# Altium schematic sheet STB_MCU.SchDoc: STB Control Board - MCU
size A3; Author: mayerph; DrawnBy: mayerph; Organization: PBL; Revision: B; SheetNumber: 5; SheetTotal: 6
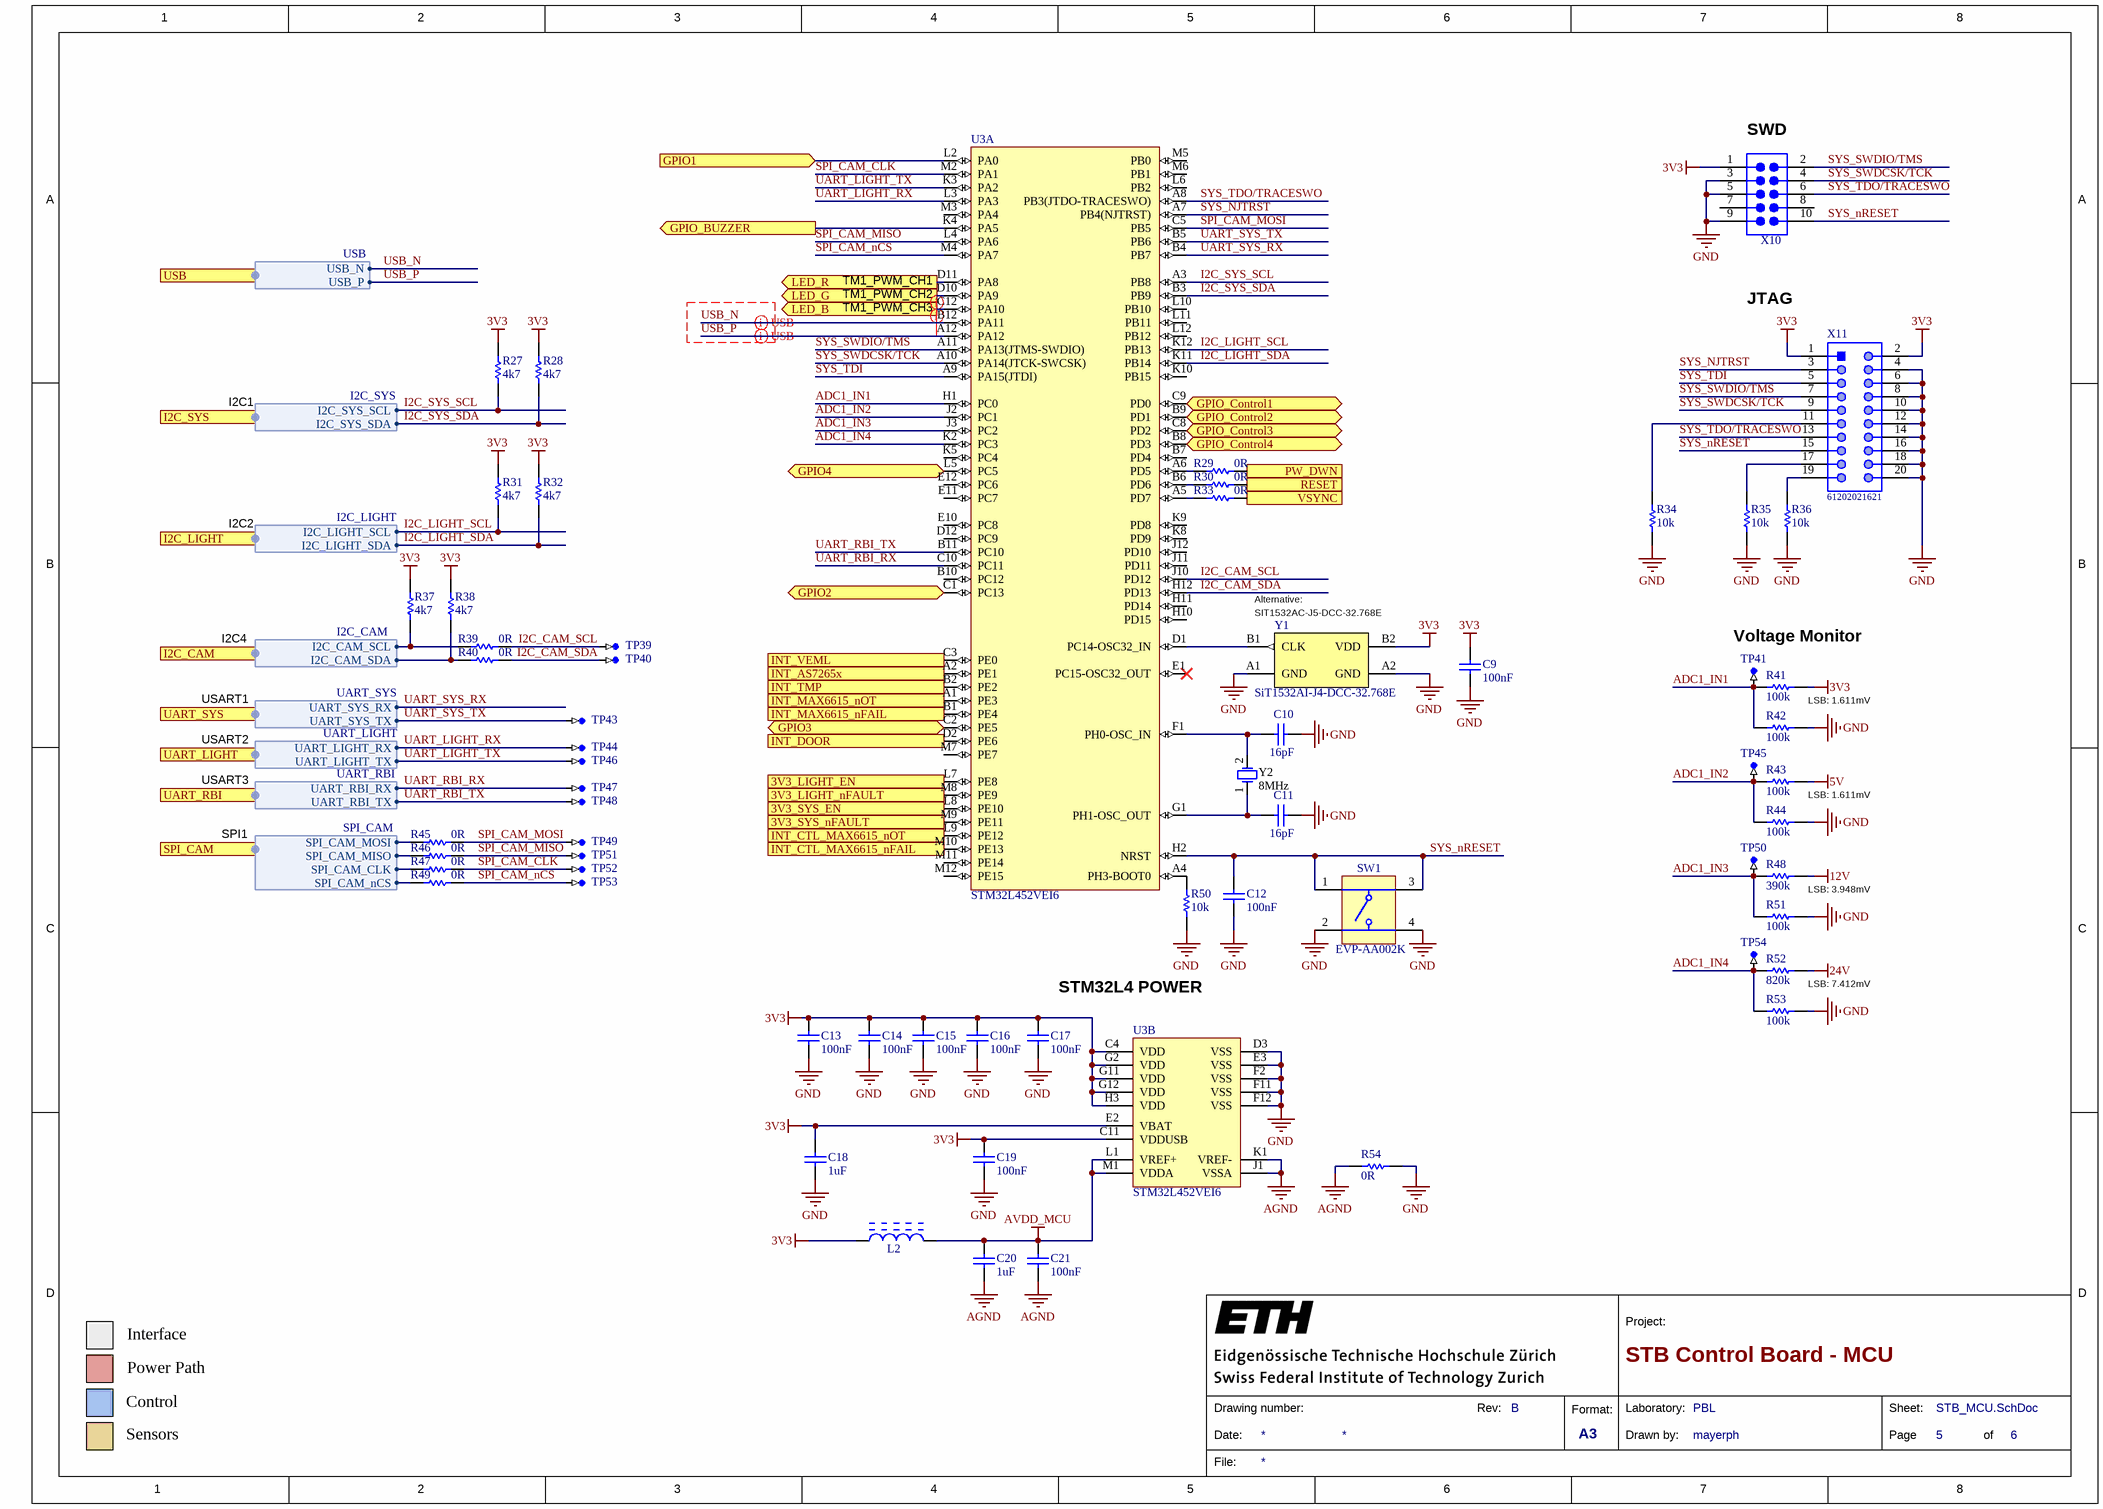
[diagram p0: STB_MCU.SchDoc]

## Parts
C9  100nF  [CAPC1050X55X23LL05T13]
C10  16pF  [CAPC1005X55X25LL05T10]
C11  16pF  [CAPC1005X55X25LL05T10]
C12  100nF  [CAPC1050X55X23LL05T13]
C13  100nF  [CAPC1050X55X23LL05T13]
C14  100nF  [CAPC1050X55X23LL05T13]
C15  100nF  [CAPC1050X55X23LL05T13]
C16  100nF  [CAPC1050X55X23LL05T13]
C17  100nF  [CAPC1050X55X23LL05T13]
C18  1uF  [CAPC1608X90X35LL15T15]
C19  100nF  [CAPC1050X55X23LL05T13]
C20  1uF  [CAPC1608X90X35LL15T15]
C21  100nF  [CAPC1050X55X23LL05T13]
L2  LI0402E300R-10  [INDC1005X07L]  (value not drawn)
R27  4k7  [RESC1005X40X25LL05T10]
R28  4k7  [RESC1005X40X25LL05T10]
R29  0R  [RESC1005X40X25LL05T10]
R30  0R  [RESC1005X40X25LL05T10]
R31  4k7  [RESC1005X40X25LL05T10]
R32  4k7  [RESC1005X40X25LL05T10]
R33  0R  [RESC1005X40X25LL05T10]
R34  10k  [RESC1005X40X25LL05T05]
R35  10k  [RESC1005X40X25LL05T05]
R36  10k  [RESC1005X40X25LL05T05]
R37  4k7  [RESC1005X40X25LL05T10]
R38  4k7  [RESC1005X40X25LL05T10]
R39  0R  [RESC1005X40X25LL05T10]
R40  0R  [RESC1005X40X25LL05T10]
R41  100k  [RESC1005X40X25LL05T10]
R42  100k  [RESC1005X40X25LL05T10]
R43  100k  [RESC1005X40X25LL05T10]
R44  100k  [RESC1005X40X25LL05T10]
R45  0R  [RESC1005X40X25LL05T10]
R46  0R  [RESC1005X40X25LL05T10]
R47  0R  [RESC1005X40X25LL05T10]
R48  390k  [RESC1005X40X25LL05T05]
R49  0R  [RESC1005X40X25LL05T10]
R50  10k  [RESC1005X40X25LL05T05]
R51  100k  [RESC1005X40X25LL05T10]
R52  820k  [RESC1005X40X25LL05T05]
R53  100k  [RESC1005X40X25LL05T10]
R54  0R  [RESC1005X40X25LL05T10]
SW1  EVP-AA002K  [PNSC-EVPAA_V]
TP39  TP_1mm  [TP-SM-C-100]  (value not drawn)  (no BOM)
TP40  TP_1mm  [TP-SM-C-100]  (value not drawn)  (no BOM)
TP41  TP_1mm  [TP-SM-C-100]  (value not drawn)  (no BOM)
TP43  TP_1mm  [TP-SM-C-100]  (value not drawn)  (no BOM)
TP44  TP_1mm  [TP-SM-C-100]  (value not drawn)  (no BOM)
TP45  TP_1mm  [TP-SM-C-100]  (value not drawn)  (no BOM)
TP46  TP_1mm  [TP-SM-C-100]  (value not drawn)  (no BOM)
TP47  TP_1mm  [TP-SM-C-100]  (value not drawn)  (no BOM)
TP48  TP_1mm  [TP-SM-C-100]  (value not drawn)  (no BOM)
TP49  TP_1mm  [TP-SM-C-100]  (value not drawn)  (no BOM)
TP50  TP_1mm  [TP-SM-C-100]  (value not drawn)  (no BOM)
TP51  TP_1mm  [TP-SM-C-100]  (value not drawn)  (no BOM)
TP52  TP_1mm  [TP-SM-C-100]  (value not drawn)  (no BOM)
TP53  TP_1mm  [TP-SM-C-100]  (value not drawn)  (no BOM)
TP54  TP_1mm  [TP-SM-C-100]  (value not drawn)  (no BOM)
U3  STM32L452VEI6  [UFBGA100]  (parts A,B of 2)
X10  3220-10-0100-00  [3220-10-0100-00]  (value not drawn)
X11  61202021621  [61202021621]
Y1  SiT1532AI-J4-DCC-32.768E  [4-UFBGA]
Y2  8MHz  [NDK-NX3225GD-8MHZ-STD-CRA-3_V]

## Ports
3V3_LIGHT_EN (out, see STB_ControlBoard[5B]), 3V3_LIGHT_nFAULT (in, see STB_ControlBoard[5B]), 3V3_SYS_EN (out, see STB_ControlBoard[5C]), 3V3_SYS_nFAULT (in, see STB_ControlBoard[5C]), GPIO1 (in, see STB_ControlBoard[5B]), GPIO2 (bidir, see STB_ControlBoard[5C]), GPIO3 (bidir, see STB_ControlBoard[5A]), GPIO4 (bidir, see STB_ControlBoard[5B]), GPIO_BUZZER (out, see STB_ControlBoard[4B]), GPIO_Control1 (bidir, see STB_ControlBoard[4B]), GPIO_Control2 (bidir, see STB_ControlBoard[4B]), GPIO_Control3 (bidir, see STB_ControlBoard[4B]), GPIO_Control4 (bidir, see STB_ControlBoard[4B]), I2C_CAM (harness I2C_CAM, see STB_ControlBoard[4C]), I2C_LIGHT (harness I2C_LIGHT, see STB_ControlBoard[5A]), I2C_SYS (harness I2C_SYS, see STB_ControlBoard[5B]), INT_AS7265x (in, see STB_ControlBoard[5C]), INT_CTL_MAX6615_nFAIL (in, see STB_ControlBoard[5C]), INT_CTL_MAX6615_nOT (in, see STB_ControlBoard[5C]), INT_DOOR (in, see STB_ControlBoard[5C]), INT_MAX6615_nFAIL (in, see STB_ControlBoard[5C]), INT_MAX6615_nOT (in, see STB_ControlBoard[5C]), INT_TMP (in, see STB_ControlBoard[5C]), INT_VEML (in, see STB_ControlBoard[5C]), LED_B (out, see STB_ControlBoard[4B]), LED_G (out, see STB_ControlBoard[4B]), LED_R (out, see STB_ControlBoard[4B]), PW_DWN (out, see STB_ControlBoard[4B]), RESET (out, see STB_ControlBoard[4B]), SPI_CAM (harness SPI_CAM, see STB_ControlBoard[4C]), UART_LIGHT (harness UART_LIGHT, see STB_ControlBoard[5A]), UART_RBI (harness UART_RBI, see STB_ControlBoard[4B]), UART_SYS (harness UART_SYS, see STB_ControlBoard[5B]), USB (harness USB, see STB_ControlBoard[4A], STB_USB[3B]), VSYNC (in, see STB_ControlBoard[4C])

## Harnesses
USB: USB_N, USB_P
I2C_SYS: I2C_SYS_SDA, I2C_SYS_SCL
I2C_LIGHT: I2C_LIGHT_SDA, I2C_LIGHT_SCL
UART_RBI: UART_RBI_TX, UART_RBI_RX
UART_SYS: UART_SYS_TX, UART_SYS_RX
UART_LIGHT: UART_LIGHT_TX, UART_LIGHT_RX
SPI_CAM: SPI_CAM_MISO, SPI_CAM_MOSI, SPI_CAM_CLK, SPI_CAM_nCS
I2C_CAM: I2C_CAM_SDA, I2C_CAM_SCL

## Nets
3V3: C9.2 C13.2 C14.2 C15.2 C16.2 C17.2 C18.2 C19.2 L2.1 R27.2 R28.2 R31.2 R32.2 R37.2 R38.2 R41.1 U3.C4(VDD) U3.C11(VDDUSB) U3.E2(VBAT) U3.G2(VDD) U3.G11(VDD) U3.G12(VDD) U3.H3(VDD) X10.1 X11.1 X11.2 Y1.B2(VDD)
5V: R43.1
12V: R48.2
24V: R52.2
AGND: C20.1 C21.1 R54.1 U3.J1(VSSA) U3.K1(VREF-)
AVDD_MCU: C20.2 C21.2 L2.2 U3.L1(VREF+) U3.M1(VDDA)
GND: C9.1 C10.2 C11.2 C12.1 C13.1 C14.1 C15.1 C16.1 C17.1 C18.1 C19.1 R34.1 R35.1 R36.1 R42.1 R44.1 R50.1 R51.1 R53.1 R54.2 SW1.2(B) SW1.4(B') U3.D3(VSS) U3.E3(VSS) U3.F2(VSS) U3.F11(VSS) U3.F12(VSS) X10.3 X10.5 X10.9 X11.4 X11.6 X11.8 X11.10 X11.12 X11.14 X11.16 X11.18 X11.20 Y1.A1(GND) Y1.A2(GND)
3V3_LIGHT_EN: U3.L7(PE8) ; port 3V3_LIGHT_EN
3V3_LIGHT_nFAULT: U3.M8(PE9) ; port 3V3_LIGHT_nFAULT
3V3_SYS_EN: U3.L8(PE10) ; port 3V3_SYS_EN
3V3_SYS_nFAULT: U3.M9(PE11) ; port 3V3_SYS_nFAULT
ADC1_IN1: R41.2 R42.2 TP41.TP U3.H1(PC0)
ADC1_IN2: R43.2 R44.2 TP45.TP U3.J2(PC1)
ADC1_IN3: R48.1 R51.2 TP50.TP U3.J3(PC2)
ADC1_IN4: R52.1 R53.2 TP54.TP U3.K2(PC3)
GPIO1: U3.L2(PA0) ; port GPIO1
GPIO2: U3.C1(PC13) ; port GPIO2
GPIO3: U3.C2(PE5) ; port GPIO3
GPIO4: U3.L5(PC5) ; port GPIO4
GPIO_BUZZER: U3.K4(PA5) ; port GPIO_BUZZER
GPIO_Control1: U3.C9(PD0) ; port GPIO_Control1
GPIO_Control2: U3.B9(PD1) ; port GPIO_Control2
GPIO_Control3: U3.C8(PD2) ; port GPIO_Control3
GPIO_Control4: U3.B8(PD3) ; port GPIO_Control4
I2C_CAM_SCL: R39.2 TP39.TP U3.J10(PD12)
I2C_CAM_SDA: R40.2 TP40.TP U3.H12(PD13)
I2C_LIGHT_SCL: R31.1 U3.K12(PB13) ; port I2C_LIGHT.I2C_LIGHT_SCL
I2C_LIGHT_SDA: R32.1 U3.K11(PB14) ; port I2C_LIGHT.I2C_LIGHT_SDA
I2C_SYS_SCL: R27.1 U3.A3(PB8) ; port I2C_SYS.I2C_SYS_SCL
I2C_SYS_SDA: R28.1 U3.B3(PB9) ; port I2C_SYS.I2C_SYS_SDA
INT_AS7265x: U3.A2(PE1) ; port INT_AS7265x
INT_CTL_MAX6615_nFAIL: U3.M10(PE13) ; port INT_CTL_MAX6615_nFAIL
INT_CTL_MAX6615_nOT: U3.L9(PE12) ; port INT_CTL_MAX6615_nOT
INT_DOOR: U3.D2(PE6) ; port INT_DOOR
INT_MAX6615_nFAIL: U3.B1(PE4) ; port INT_MAX6615_nFAIL
INT_MAX6615_nOT: U3.A1(PE3) ; port INT_MAX6615_nOT
INT_TMP: U3.B2(PE2) ; port INT_TMP
INT_VEML: U3.C3(PE0) ; port INT_VEML
LED_B: U3.C12(PA10) ; port LED_B
LED_G: U3.D10(PA9) ; port LED_G
LED_R: U3.D11(PA8) ; port LED_R
PW_DWN: R29.2 ; port PW_DWN
RESET: R30.2 ; port RESET
SPI_CAM_CLK: R47.2 TP52.TP U3.M2(PA1)
SPI_CAM_MISO: R46.2 TP51.TP U3.L4(PA6)
SPI_CAM_MOSI: R45.2 TP49.TP U3.C5(PB5)
SPI_CAM_nCS: R49.2 TP53.TP U3.M4(PA7)
SYS_NJTRST: U3.A7(PB4(NJTRST)) X11.3
SYS_nRESET: C12.2 SW1.1(A) SW1.3(A') U3.H2(NRST) X10.10 X11.15
SYS_SWDCSK/TCK: U3.A10(PA14(JTCK-SWCSK)) X10.4 X11.9
SYS_SWDIO/TMS: U3.A11(PA13(JTMS-SWDIO)) X10.2 X11.7
SYS_TDI: U3.A9(PA15(JTDI)) X11.5
SYS_TDO/TRACESWO: U3.A8(PB3(JTDO-TRACESWO)) X10.6 X11.13
UART_LIGHT_RX: TP44.TP U3.L3(PA3) ; port UART_LIGHT.UART_LIGHT_RX
UART_LIGHT_TX: TP46.TP U3.K3(PA2) ; port UART_LIGHT.UART_LIGHT_TX
UART_RBI_RX: TP47.TP U3.C10(PC11) ; port UART_RBI.UART_RBI_RX
UART_RBI_TX: TP48.TP U3.B11(PC10) ; port UART_RBI.UART_RBI_TX
UART_SYS_RX: U3.B4(PB7) ; port UART_SYS.UART_SYS_RX
UART_SYS_TX: TP43.TP U3.B5(PB6) ; port UART_SYS.UART_SYS_TX
USB_N: U3.B12(PA11) ; port USB.USB_N
USB_P: U3.A12(PA12) ; port USB.USB_P
VSYNC: R33.2 ; port VSYNC
NetC10_1: C10.1 U3.F1(PH0-OSC_IN) Y2.2
NetC11_1: C11.1 U3.G1(PH1-OSC_OUT) Y2.1
NetR29_1: R29.1 U3.A6(PD5)
NetR30_1: R30.1 U3.B6(PD6)
NetR33_1: R33.1 U3.A5(PD7)
NetR34_2: R34.2 X11.11
NetR35_2: R35.2 X11.17
NetR36_2: R36.2 X11.19
NetR37_1: R37.1 R39.1 ; port I2C_CAM.I2C_CAM_SCL
NetR38_1: R38.1 R40.1 ; port I2C_CAM.I2C_CAM_SDA
NetR45_1: R45.1 ; port SPI_CAM.SPI_CAM_MOSI
NetR46_1: R46.1 ; port SPI_CAM.SPI_CAM_MISO
NetR47_1: R47.1 ; port SPI_CAM.SPI_CAM_CLK
NetR49_1: R49.1 ; port SPI_CAM.SPI_CAM_nCS
NetR50_2: R50.2 U3.A4(PH3-BOOT0)
NetU3_D1: U3.D1(PC14-OSC32_IN) Y1.B1(CLK)

Not connected (* = marked no-connect by the designer): U3 B7(PD4) B10(PC12) D12(PC9) E1(PC15-OSC32_OUT)* E10(PC8) E11(PC7) E12(PC6) H10(PD15) H11(PD14) J11(PD11) J12(PD10) K5(PC4) K8(PD9) K9(PD8) K10(PB15) L6(PB2) L10(PB10) L11(PB11) L12(PB12) M3(PA4) M5(PB0) M6(PB1) M7(PE7) M11(PE14) M12(PE15); X10 7 8

## Layout directives
differential pair; differential pair class USB_90R: USB_N, USB_P
net class USB: USB_N, USB_P

## Notes on the sheet
- (near X10) SWD
- TM1_PWM_CH1
- TM1_PWM_CH2
- TM1_PWM_CH3
- JTAG
- I2C1
- I2C2
- I2C4
- (near Y1) Alternative:
- (near Y1) SIT1532AC-J5-DCC-32.768E
- Voltage Monitor
- USART1
- LSB: 1.611mV
- USART2
- USART3
- SPI1
- LSB: 3.948mV
- STM32L4 POWER
- LSB: 7.412mV
- 1
- 2
- 3
- 4
- 5
- 6
- 7
- 8
- A
- B
- C
- D
- Project:
- Interface
- Power Path
- Control
- Sensors
- Date:
- Drawing number:
- Rev:
- Format:
- A3
- Drawn by:
- Laboratory:
- Page
- Sheet:
- of
- File:

## Library data of the parts
C9 C12-C17 C19 C21 = CMP-2000-05439-1: Chip Capacitor, 100 nF, +/- 10%, 16 V, -55 to 125 degC, 0402 (1005 Metric), RoHS, Tape and Reel; Manufacturer: Samsung Electro-Mechanics; Manufacturer Part Number: CL05B104KO5NNNC; Dielectric: X7R; Rated Voltage: 16V; Dielectric Material: Ceramic; Multilayer: Yes; Case Size/Dimension: 0402; Tolerance (%): ±10%; Value: 100nF; Manufacturer URL: http://www.samsungsem.com/global/index.jsp; Datasheet URL: https://datasheet.ciiva.com/29198/458718-da-01-en-vs-kondensator-0402-29198423.pdf; Datasheet Version: Nov-10; Supplier 1: Digi-Key; Supplier Part Number 1: 1276-1001-6-ND; RoHS: Yes; Category: Ceramic Capacitors; Stock 1: 24854634; Pricing 1: 1=0.10000, 10=0.02400, 50=0.01300, 100=0.01050, 500=0.00752, 1000=0.00592, 2500=0.00538, 5000=0.00495 (USD); Mount: Surface Mount; Number of Pins: 2; Package Shape: Rectangular; Size Code: 0402; Terminal Finish: Nickel; Min Operating Temperature: -55°C; Max Operating Temperature: 125°C; JESD-609 Code: e3; Capacitor Type: Ceramic; Negative Tolerance: 10%; Packaging: Tape and Reel; Positive Tolerance: 10%; Rated DC Voltage (URdc): 16V; Temperature Characteristics Code: X7R; Termination: Wraparound; Package Style: SMTMeter; Length: 1mm; Width: 0.5mm; Height: 0.55mm; REACH SVHC: Yes; RoHS Compliant: Yes; ComponentLink1URL: https://datasheet.ciiva.com:443/pdfs/VipMasterIC/IC/SEMS/SEMS-S-A0008384515/SEMS-S-A0008872921-1.pdf?src-supplier=IHS+Markit; ComponentLink1Description: https://datasheet.ciiva.com:443/pdfs/VipMasterIC/IC/SEMS/SEMS-S-A0008384515/SEMS-S-A0008872921-1.pdf?src-supplier=IHS+Markit; ComponentLink2URL: https://datasheet.ciiva.com/26920/getdatasheetpartid-359683-26920169.pdf?src-supplier=Verical; ComponentLink2Description: https://datasheet.ciiva.com/26920/getdatasheetpartid-359683-26920169.pdf?src-supplier=Verical; ComponentLink3URL: https://datasheet.ciiva.com/29198/458718-da-01-en-vs-kondensator-0402-29198423.pdf?src-supplier=Conrad; ComponentLink3Description: https://datasheet.ciiva.com/29198/458718-da-01-en-vs-kondensator-0402-29198423.pdf?src-supplier=Conrad; ComponentLink4URL: https://datasheet.ciiva.com/26309/mlcc-catalogdownload2013-eng-26309003.pdf?src-supplier=Distrelec; ComponentLink4Description: https://datasheet.ciiva.com/26309/mlcc-catalogdownload2013-eng-26309003.pdf?src-supplier=Distrelec; ComponentLink5URL: https://datasheet.ciiva.com/16208/cl05b104kq5nnnc-16208343.pdf?src-supplier=Future+Electronics; ComponentLink5Description: https://datasheet.ciiva.com/16208/cl05b104kq5nnnc-16208343.pdf?src-supplier=Future+Electronics
C10 C11 = CMP-2008-03924-1: Manufacturer: Murata; Part Number: GRM1555C1H160JA01D; Dielectric Material: Ceramic; Multilayer: Yes; Negative Tolerance: 5%; Rated DC Voltage (URdc): 50V; Temperature Characteristics Code: C0G; Supplier 1: Digi-Key; Supplier Part Number 1: 490-5926-6-ND; Manufacturer Part Number: GRM1555C1H160JA01D; RoHS: Yes; Category: Ceramic Capacitors; Stock 1: 2256141; Pricing 1: 1=0.10000, 10=0.05200, 50=0.02840, 100=0.02330, 500=0.01662, 1000=0.01305, 2500=0.01187, 5000=0.01092 (USD); Mount: Surface Mount; Number of Pins: 2; Size Code: 0402; Package Shape: Rectangular; Terminal Finish: Nickel; Min Operating Temperature: -55°C; Max Operating Temperature: 125°C; Value: 16pF; Capacitor Type: Ceramic; Packaging: Tape and Reel; Positive Tolerance: 5%; JESD-609 Code: e3; Termination: Wraparound; Package Style: SMTMeter; Length: 1mm; Width: 0.5mm; Height: 0.5mm; Reach SVHC Compliant: Yes; RoHS Compliant: Yes; ComponentLink1URL: https://datasheet.ciiva.com:443/pdfs/VipMasterIC/IC/MURE/MURE-S-A0004347008/MURE-S-A0004347353-1.pdf?src-supplier=IHS+Markit; ComponentLink1Description: https://datasheet.ciiva.com:443/pdfs/VipMasterIC/IC/MURE/MURE-S-A0004347008/MURE-S-A0004347353-1.pdf?src-supplier=IHS+Markit; ComponentLink2URL: https://datasheet.ciiva.com/6256/grm1555c1h160ja01-01-6256808.pdf?src-supplier=Digi-Key; ComponentLink2Description: https://datasheet.ciiva.com/6256/grm1555c1h160ja01-01-6256808.pdf?src-supplier=Digi-Key; ComponentLink3URL: https://datasheet.ciiva.com/3778/10932grm1555c1h160ja0123-3778199.pdf?src-supplier=Arrow+Electronics; ComponentLink3Description: https://datasheet.ciiva.com/3778/10932grm1555c1h160ja0123-3778199.pdf?src-supplier=Arrow+Electronics; ComponentLink4URL: https://datasheet.ciiva.com/18184/getdatasheetpartid-319096-18184204.pdf?src-supplier=Verical; ComponentLink4Description: https://datasheet.ciiva.com/18184/getdatasheetpartid-319096-18184204.pdf?src-supplier=Verical; ComponentLink5URL: https://datasheet.ciiva.com/22698/1666664-22698393.pdf?src-supplier=Element14; ComponentLink5Description: https://datasheet.ciiva.com/22698/1666664-22698393.pdf?src-supplier=Element14; ComponentLink6URL: https://datasheet.ciiva.com/6256/partnumbering-e-01-6256810.pdf?src-supplier=Digi-Key; ComponentLink6Description: https://datasheet.ciiva.com/6256/partnumbering-e-01-6256810.pdf?src-supplier=Digi-Key; ComponentLink7URL: https://datasheet.ciiva.com/6256/partnumbering-e-01-6256812.pdf?src-supplier=Digi-Key; ComponentLink7Description: https://datasheet.ciiva.com/6256/partnumbering-e-01-6256812.pdf?src-supplier=Digi-Key; ComponentLink8URL: https://datasheet.ciiva.com/5426/product-5426941.pdf?src-supplier=Mouser; ComponentLink8Description: https://datasheet.ciiva.com/5426/product-5426941.pdf?src-supplier=Mouser
C18 C20 = CMP-2006-02298-2: Manufacturer: Kemet; Part Number: C0603C105K4RACTU; Dielectric Material: Ceramic; Multilayer: Yes; Negative Tolerance: 10%; Rated DC Voltage (URdc): 16V; Temperature Characteristics Code: X7R; Supplier 1: Digi-Key; Supplier Part Number 1: 399-C0603C105K4RAC7867DKR-ND; Manufacturer Part Number: C0603C105K4RACTU; RoHS: Yes; Category: Ceramic Capacitors; Stock 1: 1549593; Pricing 1: 1=0.10000, 10=0.07700, 50=0.04180, 100=0.03410, 500=0.02440, 1000=0.01916 (USD); Mount: Surface Mount; Number of Pins: 2; Package Shape: Rectangular; Size Code: 0603; Terminal Finish: Nickel; Min Operating Temperature: -55°C; Max Operating Temperature: 125°C; Value: 1uF; Capacitor Type: Ceramic; Packaging: Tape and Reel; Positive Tolerance: 10%; Termination: Wraparound; JESD-609 Code: e3; Package Style: SMTMeter; Length: 1.6mm; Width: 0.8mm; Height: 0.8mm; REACH SVHC: Yes; RoHS Compliant: Yes; ComponentLink1URL: https://datasheet.ciiva.com:443/pdfs/VipMasterIC/IC/KEME/KEME-S-A0008991654/KEME-S-A0008991654-1.pdf?src-supplier=IHS+Markit; ComponentLink1Description: https://datasheet.ciiva.com:443/pdfs/VipMasterIC/IC/KEME/KEME-S-A0008991654/KEME-S-A0008991654-1.pdf?src-supplier=IHS+Markit
L2 = CMP-00193-1: 30 Ohm 1 Power, Signal Line Ferrite Bead 0402 (1005 Metric) 500mA 300 mOhm Max DCR; Manufacturer: Laird-Signal Integrity Products; Number of Lines: 1; Impedance @ Frequency: 30 Ohm @ 100MHz; Packaging: Cut Tape (CT); Part Status: Active; Filter Type: Power, Signal Line; Current Rating (Max): 500mA; DC Resistance (DCR) (Max): 300 mOhm; Ratings: -; Operating Temperature: -40°C ~ 125°C; Package / Case: 0402 (1005 Metric); Mounting Type: Surface Mount; Manufacturer Part Number: LI0402E300R-10; Supplier: Digi-Key; Supplier Part Number: 240-2362-1-ND; ComponentLink1Description: Catalog_EMI%20Filtering%20&%20RF%20Inductors.pdf; ComponentLink1URL: http://cdn.lairdtech.com/home/brandworld/files/Catalog_EMI%20Filtering%20&%20RF%20Inductors.pdf
R27 R28 R31 R32 R37 R38 = CMP-1011-00586-2: Manufacturer: Yageo / Phycomp; Part Number: RC0402FR-074K7L; Tolerance: 1%; Rated Power Dissipation (P): 62.5mW; Rated Temperature: 70°C; Value: 4.7 kOhm; Temperature Coefficient: 100ppm/°C; Working Voltage: 50V; Additional Feature: LASER TRIMMABLE; Package Height: 0.35mm; Package Length: 1mm; Package Width: 0.5mm; Supplier 1: Digi-Key; Supplier Part Number 1: 311-4.7KLRDKR-ND; Manufacturer Part Number: RC0402FR-074K7L; RoHS: Yes; Category: Chip SMD Resistors; Stock 1: 23638739; Pricing 1: 1=0.10000, 10=0.01500, 100=0.00600, 1000=0.00267, 2500=0.00232, 5000=0.00192 (USD); Mount: Surface Mount; Number of Pins: 2; Package Shape: Rectangular; Size Code: 0402; Terminal Finish: Nickel; Min Operating Temperature: -55°C; Max Operating Temperature: 155°C; Resistor Type: FIXED RESISTOR; Packaging: Tape and Reel; Technology: METAL GLAZE/THICK FILM; Termination: Wraparound; JESD-609 Code: e3; Construction: Chip; Package Style: SMTMeter; REACH SVHC: Yes; RoHS Compliant: Yes; ComponentLink1URL: https://datasheet.ciiva.com:443/pdfs/VipMasterIC/IC/YAGO/YAGO-S-A0008145938/YAGO-S-A0008145938-1.pdf?src-supplier=IHS+Markit; ComponentLink1Description: https://datasheet.ciiva.com:443/pdfs/VipMasterIC/IC/YAGO/YAGO-S-A0008145938/YAGO-S-A0008145938-1.pdf?src-supplier=IHS+Markit; ComponentLink2URL: https://datasheet.ciiva.com/22661/1686128-22661342.pdf?src-supplier=Element14; ComponentLink2Description: https://datasheet.ciiva.com/22661/1686128-22661342.pdf?src-supplier=Element14; ComponentLink3URL: https://datasheet.ciiva.com/7850/1018594-7850022.pdf?src-supplier=Element14; ComponentLink3Description: https://datasheet.ciiva.com/7850/1018594-7850022.pdf?src-supplier=Element14; ComponentLink4URL: https://datasheet.ciiva.com/7850/1018594-7850023.pdf?src-supplier=Element14; ComponentLink4Description: https://datasheet.ciiva.com/7850/1018594-7850023.pdf?src-supplier=Element14; ComponentLink5URL: https://datasheet.ciiva.com/15215/getdatasheetpartid-328119-15215035.pdf?src-supplier=Verical; ComponentLink5Description: https://datasheet.ciiva.com/15215/getdatasheetpartid-328119-15215035.pdf?src-supplier=Verical
R29 R30 R33 R39 R40 R45-R47 R49 R54 = CMP-1011-00001-2: Manufacturer: Yageo / Phycomp; Part Number: RC0402JR-070RL; Rated Power Dissipation (P): 62.5mW; Rated Temperature: 70°C; Package Height: 0.35mm; Package Length: 1mm; Package Width: 0.5mm; Supplier 1: Digi-Key; Supplier Part Number 1: 311-0.0JRDKR-ND; Manufacturer Part Number: RC0402JR-070RL; RoHS: Yes; Category: Chip SMD Resistors; Stock 1: 41330354; Pricing 1: 1=0.10000, 10=0.01200, 25=0.00840, 50=0.00640, 100=0.00480, 250=0.00364, 500=0.00290, 1000=0.00214, 5000=0.00154 (USD); Mount: Surface Mount; Number of Pins: 2; Size Code: 0402; Package Shape: Rectangular; Terminal Finish: Nickel; Min Operating Temperature: -55°C; Max Operating Temperature: 155°C; Resistor Type: FIXED RESISTOR; Value: 0R; Packaging: Tape and Reel; Technology: METAL GLAZE/THICK FILM; Termination: Wraparound; JESD-609 Code: e3; Construction: Chip; Package Style: SMTMeter; REACH SVHC: Yes; RoHS Compliant: Yes; ComponentLink1URL: https://datasheet.ciiva.com:443/pdfs/VipMasterIC/IC/YAGO/YAGO-S-A0008145938/YAGO-S-A0008145938-1.pdf?src-supplier=IHS+Markit; ComponentLink1Description: https://datasheet.ciiva.com:443/pdfs/VipMasterIC/IC/YAGO/YAGO-S-A0008145938/YAGO-S-A0008145938-1.pdf?src-supplier=IHS+Markit; ComponentLink2URL: https://datasheet.ciiva.com/2452/pyu-rc0402-51-rohs-l-6-2452608.pdf?src-supplier=Digi-Key; ComponentLink2Description: https://datasheet.ciiva.com/2452/pyu-rc0402-51-rohs-l-6-2452608.pdf?src-supplier=Digi-Key; ComponentLink3URL: https://datasheet.ciiva.com/11808/0900766b80c66297-11808195.pdf?src-supplier=RSComponents; ComponentLink3Description: https://datasheet.ciiva.com/11808/0900766b80c66297-11808195.pdf?src-supplier=RSComponents; ComponentLink4URL: https://datasheet.ciiva.com/7983/1018594-7983535.pdf?src-supplier=Element14; ComponentLink4Description: https://datasheet.ciiva.com/7983/1018594-7983535.pdf?src-supplier=Element14; ComponentLink5URL: https://datasheet.ciiva.com/22747/1018594-22747515.pdf?src-supplier=Element14; ComponentLink5Description: https://datasheet.ciiva.com/22747/1018594-22747515.pdf?src-supplier=Element14; ComponentLink6URL: https://datasheet.ciiva.com/2452/pyu-r-int-thick-7-2452609.pdf?src-supplier=Digi-Key; ComponentLink6Description: https://datasheet.ciiva.com/2452/pyu-r-int-thick-7-2452609.pdf?src-supplier=Digi-Key; ComponentLink7URL: https://datasheet.ciiva.com/2452/pyu-r-int-thick-7-2452610.pdf?src-supplier=Digi-Key; ComponentLink7Description: https://datasheet.ciiva.com/2452/pyu-r-int-thick-7-2452610.pdf?src-supplier=Digi-Key; ComponentLink8URL: https://datasheet.ciiva.com/8896/pyu-rc0402-51-rohs-l-6-8896201.pdf?src-supplier=Avnet; ComponentLink8Description: https://datasheet.ciiva.com/8896/pyu-rc0402-51-rohs-l-6-8896201.pdf?src-supplier=Avnet; ComponentLink9URL: https://datasheet.ciiva.com/15189/getdatasheetpartid-326379-15189533.pdf?src-supplier=Verical; ComponentLink9Description: https://datasheet.ciiva.com/15189/getdatasheetpartid-326379-15189533.pdf?src-supplier=Verical; Parameter 1: *
R34-R36 R50 = CMP-2000-07588-1: Chip Resistor, 10 KOhm, +/- 1%, 0.1 W, -55 to 155 degC, 0402 (1005 Metric), RoHS, Tape and Reel; Manufacturer: Panasonic; Manufacturer Part Number: ERJ-2RKF1002X; Power Rating: 100mW; Voltage Rating: 50V; Value: 10 kOhm; Case\/Package: 0402; Temperature Coefficient: 100ppm\/degreesC; Rated Temperature: 70°C; Package Height: 0.35mm; Package Length: 1mm; Package Width: 0.5mm; Reference Standard: AEC-Q200; RoHSCompliant: True; Lead Free: LeadFree; Package Quantity: 1; Contact Plating: Tin; Length: 1mm; Radiation Hardening: No; REACH SVHC: NoSVHC; Max Operating Temperature: 155degC; Depth: 0.5mm; Case Code (Imperial): 0402; Military Standard: Not; Package Description: 2-Pin Surface Mount Device, Body 1 x 0.5 mm; Termination: SMD/SMT; Case Code (Metric): 1005; Height: 0.35mm; Packaging: TapeandReel; Voltage Rating (DC): 50V; Package Reference: 402; Number of Pins: 2; Tolerance: 1%; Mounting Technology: SurfaceMount; Width: 0.02inch; Mount: SurfaceMount; Datasheet URL: https://industrial.panasonic.com/cdbs/www-data/pdf/RDA0000/AOA0000C304.pdf; Composition: ThickFilm; Datasheet Version: 02/2017; Manufacturer URL: http://www.panasonic.com/; Max Power Dissipation: 100mW; Number of Terminations: 2; Min Operating Temperature: -55degC; Supplier 1: Digi-Key; Supplier Part Number 1: P10.0KLDKR-ND; RoHS: Yes; Category: Chip SMD Resistors; Stock 1: 108; Pricing 1: 1=0.10000, 10=0.03300, 100=0.01330, 1000=0.00599, 2500=0.00520, 5000=0.00429 (USD); Size Code: 0402; Terminal Finish: Nickel; Package Shape: Rectangular; Resistor Type: FIXED RESISTOR; Rated Power Dissipation (P): 100mW; Technology: METAL GLAZE/THICK FILM; Working Voltage: 50V; Construction: Rectangular; Package Style: SMTMeter; JESD-609 Code: e3; RoHS Compliant: Yes; ComponentLink1URL: https://datasheet.ciiva.com:443/pdfs/VipMasterIC/IC/PANA/PANA-S-A0009889626/PANA-S-A0009889626-1.pdf?src-supplier=IHS+Markit; ComponentLink1Description: https://datasheet.ciiva.com:443/pdfs/VipMasterIC/IC/PANA/PANA-S-A0009889626/PANA-S-A0009889626-1.pdf?src-supplier=IHS+Markit; ComponentLink2URL: https://datasheet.ciiva.com/11821/0900766b80f80784-11821171.pdf?src-supplier=RSComponents; ComponentLink2Description: https://datasheet.ciiva.com/11821/0900766b80f80784-11821171.pdf?src-supplier=RSComponents; ComponentLink3URL: https://datasheet.ciiva.com/27055/1987020-27055643.pdf?src-supplier=Jameco; ComponentLink3Description: https://datasheet.ciiva.com/27055/1987020-27055643.pdf?src-supplier=Jameco; ComponentLink4URL: https://datasheet.ciiva.com/43467/1678782-43467402.pdf?src-supplier=Farnell; ComponentLink4Description: https://datasheet.ciiva.com/43467/1678782-43467402.pdf?src-supplier=Farnell; ComponentLink5URL: https://datasheet.ciiva.com/28514/1678782-28514185.pdf?src-supplier=Element14; ComponentLink5Description: https://datasheet.ciiva.com/28514/1678782-28514185.pdf?src-supplier=Element14; ComponentLink6URL: https://datasheet.ciiva.com/24023/aoa0000ce2-24023017.pdf?src-supplier=Mouser; ComponentLink6Description: https://datasheet.ciiva.com/24023/aoa0000ce2-24023017.pdf?src-supplier=Mouser; ComponentLink7URL: https://datasheet.ciiva.com/16782/70260748-16782590.pdf?src-supplier=Allied+Electronics; ComponentLink7Description: https://datasheet.ciiva.com/16782/70260748-16782590.pdf?src-supplier=Allied+Electronics; ComponentLink8URL: https://datasheet.ciiva.com/16786/70260748-16786734.pdf?src-supplier=Allied+Electronics; ComponentLink8Description: https://datasheet.ciiva.com/16786/70260748-16786734.pdf?src-supplier=Allied+Electronics; ComponentLink9URL: https://datasheet.ciiva.com/9194/aoa0000ce2-9194142.pdf?src-supplier=Avnet; ComponentLink9Description: https://datasheet.ciiva.com/9194/aoa0000ce2-9194142.pdf?src-supplier=Avnet; ComponentLink10URL: https://datasheet.ciiva.com/16199/aoa0000ce2-16199478.pdf?src-supplier=Future+Electronics; ComponentLink10Description: https://datasheet.ciiva.com/16199/aoa0000ce2-16199478.pdf?src-supplier=Future+Electronics; ComponentLink11URL: https://datasheet.ciiva.com/48531/aoa0000ce2-48531069.pdf?src-supplier=Avnet; ComponentLink11Description: https://datasheet.ciiva.com/48531/aoa0000ce2-48531069.pdf?src-supplier=Avnet; ComponentLink12URL: https://datasheet.ciiva.com/30201/aoa0000ce2-30201022.pdf?src-supplier=Onlinecomponents.com; ComponentLink12Description: https://datasheet.ciiva.com/30201/aoa0000ce2-30201022.pdf?src-supplier=Onlinecomponents.com
R41-R44 R51 R53 = CMP-2002-07343-1: Part Number: RC0402FR-07100KL; Manufacturer: Yageo / Phycomp; Tolerance: 1%; Rated Power Dissipation (P): 62.5mW; Rated Temperature: 70°C; Value: 100 kOhm; Temperature Coefficient: 100ppm/°C; Working Voltage: 50V; Additional Feature: LASER TRIMMABLE; Package Height: 0.35mm; Package Length: 1mm; Package Width: 0.5mm; Supplier 1: Digi-Key; Supplier Part Number 1: 311-100KLRDKR-ND; Manufacturer Part Number: RC0402FR-07100KL; RoHS: Yes; Category: Chip SMD Resistors; Stock 1: 43269933; Pricing 1: 1=0.10000, 10=0.01500, 100=0.00600, 1000=0.00267, 2500=0.00232, 5000=0.00192 (USD); Mount: Surface Mount; Number of Pins: 2; Size Code: 0402; Terminal Finish: Nickel; Package Shape: Rectangular; Min Operating Temperature: -55°C; Max Operating Temperature: 155°C; Resistor Type: FIXED RESISTOR; Technology: METAL GLAZE/THICK FILM; Termination: Wraparound; JESD-609 Code: e3; Construction: Chip; Package Style: SMTMeter; Packaging: Tape and Reel; REACH SVHC: Yes; RoHS Compliant: Yes; ComponentLink1URL: https://datasheet.ciiva.com:443/pdfs/VipMasterIC/IC/YAGO/YAGO-S-A0008145938/YAGO-S-A0008145938-1.pdf?src-supplier=IHS+Markit; ComponentLink1Description: https://datasheet.ciiva.com:443/pdfs/VipMasterIC/IC/YAGO/YAGO-S-A0008145938/YAGO-S-A0008145938-1.pdf?src-supplier=IHS+Markit
R48 = CMP-2002-01150-1: Part Number: ERJ2RKF3903X; Manufacturer: Panasonic; Manufacturer Part Number: ERJ-2RKF3903X; Tolerance: 1%; Rated Power Dissipation (P): 100mW; Value: 390 kOhm; Temperature Coefficient: 100ppm/°C; Working Voltage: 50V; Rated Temperature: 70°C; Package Height: 0.35mm; Package Length: 1mm; Package Width: 0.5mm; Reference Standard: AEC-Q200; Supplier 1: Digi-Key; Supplier Part Number 1: P390KLDKR-ND; RoHS: Yes; Category: Chip SMD Resistors; Stock 1: 16645; Pricing 1: 1=0.10000, 10=0.03300, 100=0.01330, 1000=0.00599, 2500=0.00520, 5000=0.00429 (USD); Mount: Surface Mount; Number of Pins: 2; Size Code: 0402; Terminal Finish: Nickel; Package Shape: Rectangular; Min Operating Temperature: -55°C; Max Operating Temperature: 155°C; JESD-609 Code: e3; Resistor Type: FIXED RESISTOR; Technology: METAL GLAZE/THICK FILM; Construction: Rectangular; Package Style: SMTMeter; Packaging: Tape and Reel; Termination: Wraparound; REACH SVHC: Yes; RoHS Compliant: Yes; ComponentLink1URL: https://datasheet.ciiva.com:443/pdfs/VipMasterIC/IC/PANA/PANA-S-A0009889626/PANA-S-A0009889626-1.pdf?src-supplier=IHS+Markit; ComponentLink1Description: https://datasheet.ciiva.com:443/pdfs/VipMasterIC/IC/PANA/PANA-S-A0009889626/PANA-S-A0009889626-1.pdf?src-supplier=IHS+Markit; ComponentLink2URL: https://datasheet.ciiva.com/11821/0900766b80f80784-11821283.pdf?src-supplier=RSComponents; ComponentLink2Description: https://datasheet.ciiva.com/11821/0900766b80f80784-11821283.pdf?src-supplier=RSComponents; ComponentLink3URL: https://datasheet.ciiva.com/16764/70260748-16764280.pdf?src-supplier=Allied+Electronics; ComponentLink3Description: https://datasheet.ciiva.com/16764/70260748-16764280.pdf?src-supplier=Allied+Electronics; ComponentLink4URL: https://datasheet.ciiva.com/9182/aoa0000ce2-9182363.pdf?src-supplier=Avnet; ComponentLink4Description: https://datasheet.ciiva.com/9182/aoa0000ce2-9182363.pdf?src-supplier=Avnet; ComponentLink5URL: https://datasheet.ciiva.com/22681/1678782-22681165.pdf?src-supplier=Element14; ComponentLink5Description: https://datasheet.ciiva.com/22681/1678782-22681165.pdf?src-supplier=Element14; ComponentLink6URL: https://datasheet.ciiva.com/46373/1678782-46373573.pdf?src-supplier=Element14; ComponentLink6Description: https://datasheet.ciiva.com/46373/1678782-46373573.pdf?src-supplier=Element14; ComponentLink7URL: https://datasheet.ciiva.com/7711/1678782-7711046.pdf?src-supplier=Element14; ComponentLink7Description: https://datasheet.ciiva.com/7711/1678782-7711046.pdf?src-supplier=Element14; ComponentLink8URL: https://datasheet.ciiva.com/9182/aoa0000ce2-9182360.pdf?src-supplier=Avnet; ComponentLink8Description: https://datasheet.ciiva.com/9182/aoa0000ce2-9182360.pdf?src-supplier=Avnet; ComponentLink9URL: https://datasheet.ciiva.com/24025/aoa0000ce2-24025100.pdf?src-supplier=Mouser; ComponentLink9Description: https://datasheet.ciiva.com/24025/aoa0000ce2-24025100.pdf?src-supplier=Mouser; ComponentLink10URL: https://datasheet.ciiva.com/16785/70260748-16785997.pdf?src-supplier=Allied+Electronics; ComponentLink10Description: https://datasheet.ciiva.com/16785/70260748-16785997.pdf?src-supplier=Allied+Electronics; ComponentLink11URL: https://datasheet.ciiva.com/30263/aoa0000ce2-30263919.pdf?src-supplier=Onlinecomponents.com; ComponentLink11Description: https://datasheet.ciiva.com/30263/aoa0000ce2-30263919.pdf?src-supplier=Onlinecomponents.com
R52 = CMP-2002-00230-1: Part Number: CRCW0402820KFKED; Manufacturer: Vishay Dale; Tolerance: 1%; Rated Power Dissipation (P): 63mW; Value: 820 kOhm; Temperature Coefficient: 100ppm/°C; Working Voltage: 50V; Rated Temperature: 70°C; Package Height: 0.35mm; Package Length: 1mm; Package Width: 0.5mm; Reference Standard: AEC-Q200; Supplier 1: Digi-Key; Supplier Part Number 1: 541-820KLDKR-ND; Manufacturer Part Number: CRCW0402820KFKED; RoHS: Yes; Category: Chip SMD Resistors; Stock 1: 1266; Pricing 1: 1=0.10000, 10=0.03600, 100=0.01460, 1000=0.00656, 2500=0.00569, 5000=0.00470 (USD); Mount: Surface Mount; Number of Pins: 2; Size Code: 0402; Package Shape: Rectangular; Terminal Finish: Nickel; Min Operating Temperature: -55°C; Max Operating Temperature: 155°C; Resistor Type: FIXED RESISTOR; Packaging: Tape and Reel; Technology: METAL GLAZE/THICK FILM; JESD-609 Code: e3; Termination: Wraparound; Construction: Chip; Package Style: SMTMeter; REACH SVHC: Yes; RoHS Compliant: Yes; ComponentLink1URL: https://datasheet.ciiva.com:443/pdfs/VipMasterIC/IC/VISH/VISH-S-A0007266705/VISH-S-A0007266705-1.pdf?src-supplier=IHS+Markit; ComponentLink1Description: https://datasheet.ciiva.com:443/pdfs/VipMasterIC/IC/VISH/VISH-S-A0007266705/VISH-S-A0007266705-1.pdf?src-supplier=IHS+Markit; ComponentLink2URL: https://datasheet.ciiva.com/5540/dcrcwe3-109170-5540880.pdf?src-supplier=Mouser; ComponentLink2Description: https://datasheet.ciiva.com/5540/dcrcwe3-109170-5540880.pdf?src-supplier=Mouser; ComponentLink3URL: https://datasheet.ciiva.com/11818/0900766b80d98824-11818128.pdf?src-supplier=RSComponents; ComponentLink3Description: https://datasheet.ciiva.com/11818/0900766b80d98824-11818128.pdf?src-supplier=RSComponents; ComponentLink4URL: https://datasheet.ciiva.com/22675/1847332-22675559.pdf?src-supplier=Element14; ComponentLink4Description: https://datasheet.ciiva.com/22675/1847332-22675559.pdf?src-supplier=Element14; ComponentLink5URL: https://datasheet.ciiva.com/22706/1697337-22706232.pdf?src-supplier=Element14; ComponentLink5Description: https://datasheet.ciiva.com/22706/1697337-22706232.pdf?src-supplier=Element14; ComponentLink6URL: https://datasheet.ciiva.com/16494/dcrcwe3-16494457.pdf?src-supplier=Future+Electronics; ComponentLink6Description: https://datasheet.ciiva.com/16494/dcrcwe3-16494457.pdf?src-supplier=Future+Electronics; ComponentLink7URL: https://datasheet.ciiva.com/26316/fld-crcw-e3-data-en-26316601.pdf?src-supplier=Distrelec; ComponentLink7Description: https://datasheet.ciiva.com/26316/fld-crcw-e3-data-en-26316601.pdf?src-supplier=Distrelec; ComponentLink8URL: https://datasheet.ciiva.com/7743/dcrcwe3-7743755.pdf?src-supplier=Element14; ComponentLink8Description: https://datasheet.ciiva.com/7743/dcrcwe3-7743755.pdf?src-supplier=Element14; ComponentLink9URL: https://datasheet.ciiva.com/16775/70201119-16775659.pdf?src-supplier=Allied+Electronics; ComponentLink9Description: https://datasheet.ciiva.com/16775/70201119-16775659.pdf?src-supplier=Allied+Electronics
SW1 = CMP-2000-06231-1: Light Touch Switch, 100 mOhm, -40 to 85 degC, 4-Pin SMD, RoHS, Tape and Reel; Manufacturer: Panasonic; Manufacturer Series: EVPAA; Electrical Life: 1000000Cycles; Switch Configuration: N.O.; COO: JP; Actuator Color: Black; Contact Rating @ Voltage: 0.02@15VDCA; Dielectric Strength: 250VAC; Actuator Length: 0.3mm; Ground Terminal: No; Operating Force: 1N; Pole Throw Configuration: SPST; Body Orientation: Straight; Illumination Type: N/R; Maximum DC Voltage Rating: 15V; Actuator Style: RectangularButton; Actuator Angle: 0°; Actuator Travel: 0.127mm; Actuator Type: Pushbutton; Circuit Configuration: 1X1; Contact Bounce Time-Max: 10ms; Contact Current(DC)-Max: 20mA; Contact DC Max Rating R Load: .02A@15VDC; Contact Function: OFF-(ON); Contact Resistance: 0.1mR; Contact Timing: SNAP ACTION; Dielectric Withstand Volts: 250VACV; Insulation Resistance: 100MR; Number of Switches: 1; Switch Action: MOMENTARY; Switch Type: Keypad; Body Breadth: 2.9inch; Body Height: 1.4mm; Body Length or Diameter: 3.5mm; Sealing: MOLDED; Maximum AC Voltage Rating: N/A; Package Description: 4-Pin Surface Mount Device, Body 2.9 x 3.5 mm, Pitch 1.45 mm; Family: EVPAA; Contact Material: N/A; Mounting: SurfaceMount,J-Bend; Datasheet Version: 04/2016; Housing Material: N/A; Product Weight: N/A; RoHS: Yes; Mechanical Life: N/A; Minimum Insulation Resistance: 100MOhm; Operating Temperature: -40to85C; Mounting Technology: SurfaceMount; HTS: 8507204000; Dimension: 4.3x2.9x1.7mm; Maximum Contact Resistance: 100mOhm; Base Material: N/A; Seal Location: N/A; Supplier Standard Pack: 5,000; Supplier: PanasonicIndustrialDevices; Datasheet URL: https://industrial.panasonic.com/cdbs/www-data/pdf/ATV0000/ATV0000C1.pdf; Packaging: EmbossedTapeandReel; Manufacturer URL: http://www.panasonic.com/; Seal Description: N/A; Contact Plating: N/A; ECCN: EAR99; Package Reference: EVPAA; Type: LightTouch; Part No: EVP-AA002K; Supplier 1: Digi-Key; Supplier Part Number 1: P13347SDKR-ND; Manufacturer Part Number: EVP-AA002K; Category: Tactile Switches; Stock 1: 2300; Pricing 1: 1=0.87000, 10=0.83400, 25=0.80200, 100=0.69610, 250=0.63516, 500=0.59026, 1000=0.52930, 2500=0.49722 (USD); Mount: Surface Mount; Body Color: Black; Min Operating Temperature: -40°C; Max Operating Temperature: 85°C; Contact Voltage(DC)-Max: 15V; Operating Force-Max: 1N; Switch Function: SPST; Termination: Solder; REACH SVHC: Yes; RoHS Compliant: Yes; ComponentLink1URL: https://datasheet.ciiva.com:443/pdfs/VipMasterIC/IC/PANA/PANA-S-A0001791376/PANA-S-A0001791376-1.pdf?src-supplier=IHS+Markit; ComponentLink1Description: https://datasheet.ciiva.com:443/pdfs/VipMasterIC/IC/PANA/PANA-S-A0001791376/PANA-S-A0001791376-1.pdf?src-supplier=IHS+Markit; ComponentLink2URL: https://datasheet.ciiva.com/24076/atk0000pe184-69004-24076293.pdf?src-supplier=Mouser; ComponentLink2Description: https://datasheet.ciiva.com/24076/atk0000pe184-69004-24076293.pdf?src-supplier=Mouser; ComponentLink3URL: https://datasheet.ciiva.com/30108/atk0000ce26-30108515.pdf?src-supplier=Onlinecomponents.com; ComponentLink3Description: https://datasheet.ciiva.com/30108/atk0000ce26-30108515.pdf?src-supplier=Onlinecomponents.com; ComponentLink4URL: https://datasheet.ciiva.com/17016/70270676-17016874.pdf?src-supplier=Allied+Electronics; ComponentLink4Description: https://datasheet.ciiva.com/17016/70270676-17016874.pdf?src-supplier=Allied+Electronics; ComponentLink5URL: https://datasheet.ciiva.com/16395/atk0000ce26-16395244.pdf?src-supplier=Future+Electronics; ComponentLink5Description: https://datasheet.ciiva.com/16395/atk0000ce26-16395244.pdf?src-supplier=Future+Electronics; ComponentLink6URL: https://datasheet.ciiva.com/2899/atk0000ce26-2899991.pdf?src-supplier=Digi-Key; ComponentLink6Description: https://datasheet.ciiva.com/2899/atk0000ce26-2899991.pdf?src-supplier=Digi-Key; ComponentLink7URL: https://datasheet.ciiva.com/2899/atk0000ce26-2899992.pdf?src-supplier=Digi-Key; ComponentLink7Description: https://datasheet.ciiva.com/2899/atk0000ce26-2899992.pdf?src-supplier=Digi-Key; ComponentLink8URL: https://datasheet.ciiva.com/2899/atk0000ce26-2899990.pdf?src-supplier=Digi-Key; ComponentLink8Description: https://datasheet.ciiva.com/2899/atk0000ce26-2899990.pdf?src-supplier=Digi-Key
TP39-TP41 TP43-TP54 = testPoint_1mm: testPoint 1mm
U3 = CMP-00955-1: IC MCU 32BIT 512KB FLASH 100UFBGA; Manufacturer: STMicroelectronics; Core Processor: ARM Cortex-M4; Core Size: 32-Bit; Speed: 80MHz; Connectivity: CAN, I²C, IrDA, LIN, MMC/SD, QSPI, SAI, SPI, UART/USART, USB; Peripherals: Brown-out Detect/Reset, DMA, PWM, WDT; Numer of I/O: 83; Program Memory Size: 512KB (512K x 8); RAM Size: 160K x 8; Data Converters: A/D 16x12b, D/A 1x12b; Voltage - Supply (Vcc/Vdd): 1.71 V ~ 3.6 V; Oscillator Type: Internal; Manufacturer Part Number: STM32L452VEI6; Supplier: Digi-Key; Supplier Part Number: 497-17222-ND; Series: STM32L4; Program Memory Type: FLASH; Operating Temperature: -40°C ~ 85°C (TA); Package / Case: 100-UFBGA; Supplier Device Package: 100-UFBGA (7x7); PartId: 1
X10 = CMP-00143-1: BOX HEADER, 0.050 5x2 POS; Manufacturer: CNC Tech; Connector Type: Header, Shrouded; Number of Positions: 10; Number of Positions Loaded: All; Packaging: Tray; Contact Type: Male Pin; Number of Rows: 2; Contact Mating Length: -; Mounting Type: Through Hole; Termination: Solder; Fastening Type: -; Features: -; Contact Finish: Gold; Contact Finish Thickness: Flash; Color: -; Manufacturer Part Number: 3220-10-0100-00; Supplier: Digi-Key; Supplier Part Number: 1175-1627-ND; ComponentLink1Description: 3220-XX-0100-00.pdf; ComponentLink1URL: http://cnctech.us/pdfs/3220-XX-0100-00.pdf
X11 = CMP-1502-00010-1: Male Box Header WR-BHD, THT, Vertical, pitch 2.54 mm, 20 pins; Manufacturer: Wurth Elektronik; Contact Resistance: 20mOhm; Withstanding Voltage: 500VAC; Pitch: 2.54mm; Pin Number: 20; Working Voltage: 250VAC; Connector Type: Male Pin; Current Rating: 3A; Voltage Rating: 250V; Insulation Resistance: 1GR; Insulation: Insulated; Row Spacing: 0.1inch; Orientation: Vertical; Package Reference: 61202021621; Publisher: WurthElektronik; Datasheet URL: https://katalog.we-online.de/em/datasheet/6120xx21621.pdf; Operating Temperature: -40to125degC; Packaging: Tray; Part Number: 61202021621; Mounting Technology: THT; Gender: Male; Manufacturer URL: http://www.we-online.de; Published Date: August2018; Supplier 1: Digi-Key; Supplier Part Number 1: 732-2096-ND; Manufacturer Part Number: 61202021621; RoHS: Yes; Category: Headers and Wire Housings; Stock 1: 19791; Pricing 1: 1=0,95000, 10=0,93200, 50=0,85900, 160=0,76900, 320=0,68000 (USD); Mount: Through Hole; Contact Plating: Gold; Contact Material: Copper Alloy,Copper; Color: Black; Housing Material: PBT; Min Operating Temperature: -40°C; Max Operating Temperature: 125°C; Number of Rows: 2; Number of Positions: 20; Termination: Through Hole; Number of Contacts: 20; Series: WR-BHD; Package Quantity: 160; Contact Type: Male Pin; Contact Gender: Male; Length: 33.06mm; Width: 33.06mm; Height: 8.85mm; REACH SVHC: Unknown; RoHS Compliant: Yes; Flammability Rating: UL94 V-0; ComponentLink1URL: https://datasheet.ciiva.com/731/6120xx21621-731346.pdf?src-supplier=Digi-Key; ComponentLink1Description: https://datasheet.ciiva.com/731/6120xx21621-731346.pdf?src-supplier=Digi-Key
Y1 = CMP-01647-1: Manufacturer: SiTime; Frequency: 32.768kHz; Frequency Stability: 100ppm; Max Supply Current: 1.4uA; Load Capacitance: 10pF; Min Supply Voltage: 1.5V; Max Supply Voltage: 3.63V; Current Rating: 1.35uA; Max Duty Cycle: 52%; Supplier 1: Digi-Key; Supplier Part Number 1: 1473-1240-2-ND; Manufacturer Part Number: SiT1532AI-J4-DCC-32.768E; RoHS: Yes; Category: Oscillators; Pricing 1: 1000=0.69900 (USD); Mount: Surface Mount; Min Operating Temperature: -40°C; Max Operating Temperature: 85°C; Packaging: Tape and Reel; Termination: SMD/SMT; Package Quantity: 1000; Length: 0.061inch; Width: 0.8mm; Height: 0.024inch; RoHS Compliant: Yes; Lead Free: Lead Free; ComponentLink1URL: http://www.mouser.com/ds/2/371/SiT1532-datasheet-275319.pdf?src-supplier=Mouser; ComponentLink1Description: http://www.mouser.com/ds/2/371/SiT1532-datasheet-275319.pdf?src-supplier=Mouser; ComponentLink2URL: http://www.farnell.com/datasheets/2581505.pdf?src-supplier=Farnell; ComponentLink2Description: http://www.farnell.com/datasheets/2581505.pdf?src-supplier=Farnell; ComponentLink3URL: http://www.farnell.com/datasheets/2581505.pdf?src-supplier=Newark; ComponentLink3Description: http://www.farnell.com/datasheets/2581505.pdf?src-supplier=Newark; ComponentLink4URL: http://www.sitime.com/products/datasheets/sit1532/SiT1532-datasheet.pdf?src-supplier=Digi-Key; ComponentLink4Description: http://www.sitime.com/products/datasheets/sit1532/SiT1532-datasheet.pdf?src-supplier=Digi-Key; ComponentLink5URL: https://www.sitime.com/datasheet/SiT1532?src-supplier=Digi-Key; ComponentLink5Description: https://www.sitime.com/datasheet/SiT1532?src-supplier=Digi-Key
Y2 = CMP-2000-07595-1: Crystal Unit, 8 MHz, 8 pF, -40 to 150 degC, 2-Pin SMD, RoHS, Tape and Reel; Manufacturer: NDK; Manufacturer Part Number: NX3225GD-8MHZ-STD-CRA-3; Load Capacitance: 8pF; ESR (Equivalent Series Resistance): 500Ohm; Frequency Tolerance: 50ppm; Frequency Stability: 150ppm; Case/Package: SMD/SMT; Datasheet Version: 11/2016; Min Operating Temperature: -40degC; Packaging: TapeandReel; Width: 0.098inch; Package Quantity: 3000; Number of Pins: 2; Package Description: 2-Pin Surface Mount Device, Body 3.2 x 2.5 mm; RoHSCompliant: True; Package Reference: NX3225GD-8MHZ-STD-CRA-3; Datasheet URL: http://www.ndk.com/images/products/catalog/c_NX3225GD-STD-CRA-3_e.pdf; Mounting Technology: SurfaceMount; Length: 0.126inch; Mount: SurfaceMount; Manufacturer URL: http://www.ndk.com/en/; Max Operating Temperature: 150degC; Frequency: 8MHz; Height: 0.039inch; Supplier 1: Digi-Key; Supplier Part Number 1: 644-1178-2-ND; RoHS: Yes; Category: Crystals; ComponentLink1URL: https://datasheet.ciiva.com/6732/c-nx3225gd-std-cra-3-e-6732944.pdf?src-supplier=Digi-Key; ComponentLink1Description: https://datasheet.ciiva.com/6732/c-nx3225gd-std-cra-3-e-6732944.pdf?src-supplier=Digi-Key